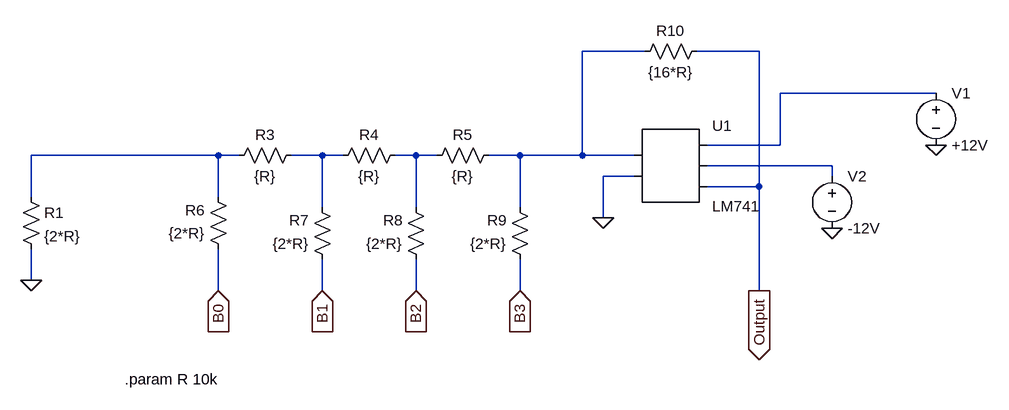
[diagram p0: schematic R_2R_multiplier.asc]
R_2R_multiplier.asc, the LTspice schematic file:
Version 4
SHEET 1 1372 680
WIRE 832 -112 736 -112
WIRE 1008 -112 912 -112
WIRE 1280 -48 1040 -48
WIRE 1040 32 1040 -48
WIRE 1040 32 928 32
WIRE 176 48 -112 48
WIRE 208 48 176 48
WIRE 336 48 288 48
WIRE 368 48 336 48
WIRE 480 48 448 48
WIRE 512 48 480 48
WIRE 640 48 592 48
WIRE 736 48 736 -112
WIRE 736 48 640 48
WIRE 816 48 736 48
WIRE 1120 64 928 64
WIRE 816 80 768 80
WIRE 1120 80 1120 64
WIRE 1008 96 1008 -112
WIRE 1008 96 928 96
WIRE -112 112 -112 48
WIRE 176 112 176 48
WIRE 336 128 336 48
WIRE 480 128 480 48
WIRE 640 128 640 48
WIRE 768 144 768 80
WIRE -112 240 -112 192
WIRE 176 256 176 192
WIRE 336 256 336 208
WIRE 480 256 480 208
WIRE 640 256 640 208
WIRE 1008 256 1008 96
FLAG -112 240 0
FLAG 768 144 0
FLAG 1280 32 0
FLAG 1120 160 0
FLAG 1008 256 Output
IOPIN 1008 256 Out
FLAG 176 256 B0
IOPIN 176 256 In
FLAG 336 256 B1
IOPIN 336 256 In
FLAG 480 256 B2
IOPIN 480 256 In
FLAG 640 256 B3
IOPIN 640 256 In
SYMBOL res -128 96 R0
SYMATTR InstName R1
SYMATTR Value {2*R}
SYMBOL res 304 32 R90
WINDOW 0 0 56 VBottom 2
WINDOW 3 32 56 VTop 2
SYMATTR InstName R3
SYMATTR Value {R}
SYMBOL res 464 32 R90
WINDOW 0 0 56 VBottom 2
WINDOW 3 32 56 VTop 2
SYMATTR InstName R4
SYMATTR Value {R}
SYMBOL res 608 32 R90
WINDOW 0 0 56 VBottom 2
WINDOW 3 32 56 VTop 2
SYMATTR InstName R5
SYMATTR Value {R}
SYMBOL res 192 208 R180
WINDOW 0 36 76 Left 2
WINDOW 3 36 40 Left 2
SYMATTR InstName R6
SYMATTR Value {2*R}
SYMBOL res 352 224 R180
WINDOW 0 36 76 Left 2
WINDOW 3 36 40 Left 2
SYMATTR InstName R7
SYMATTR Value {2*R}
SYMBOL res 496 224 R180
WINDOW 0 36 76 Left 2
WINDOW 3 36 40 Left 2
SYMATTR InstName R8
SYMATTR Value {2*R}
SYMBOL res 656 224 R180
WINDOW 0 36 76 Left 2
WINDOW 3 36 40 Left 2
SYMATTR InstName R9
SYMATTR Value {2*R}
SYMBOL AutoGenerated\\LM741 864 64 R0
SYMATTR InstName U1
SYMBOL res 928 -128 R90
WINDOW 0 0 56 VBottom 2
WINDOW 3 32 56 VTop 2
SYMATTR InstName R10
SYMATTR Value {16*R}
SYMBOL voltage 1280 -64 R0
WINDOW 123 0 0 Left 0
WINDOW 39 0 0 Left 0
SYMATTR InstName V1
SYMATTR Value +12V
SYMBOL voltage 1120 64 R0
WINDOW 123 0 0 Left 0
WINDOW 39 0 0 Left 0
SYMATTR InstName V2
SYMATTR Value -12V
TEXT 32 392 Left 2 !.param R 10k

The netlist it stands for:
* R_2R_multiplier.asc
R1 N003 0 {2*R}
R3 N004 N003 {R}
R4 N005 N004 {R}
R5 N001 N005 {R}
R6 B0 N003 {2*R}
R7 B1 N004 {2*R}
R8 B2 N005 {2*R}
R9 B3 N001 {2*R}
* U1: LM741 (symbol AutoGenerated\LM741 not available, pins judged from their places): pin1=N001 pin2=0 pin3=N002 pin4=N006 pin5=Output
R10 Output N001 {16*R}
V1 N002 0 +12V
V2 N006 0 -12V
.param R 10k
.backanno
.end